# EAGLE design Sensor Board (EAGLE 6.4)
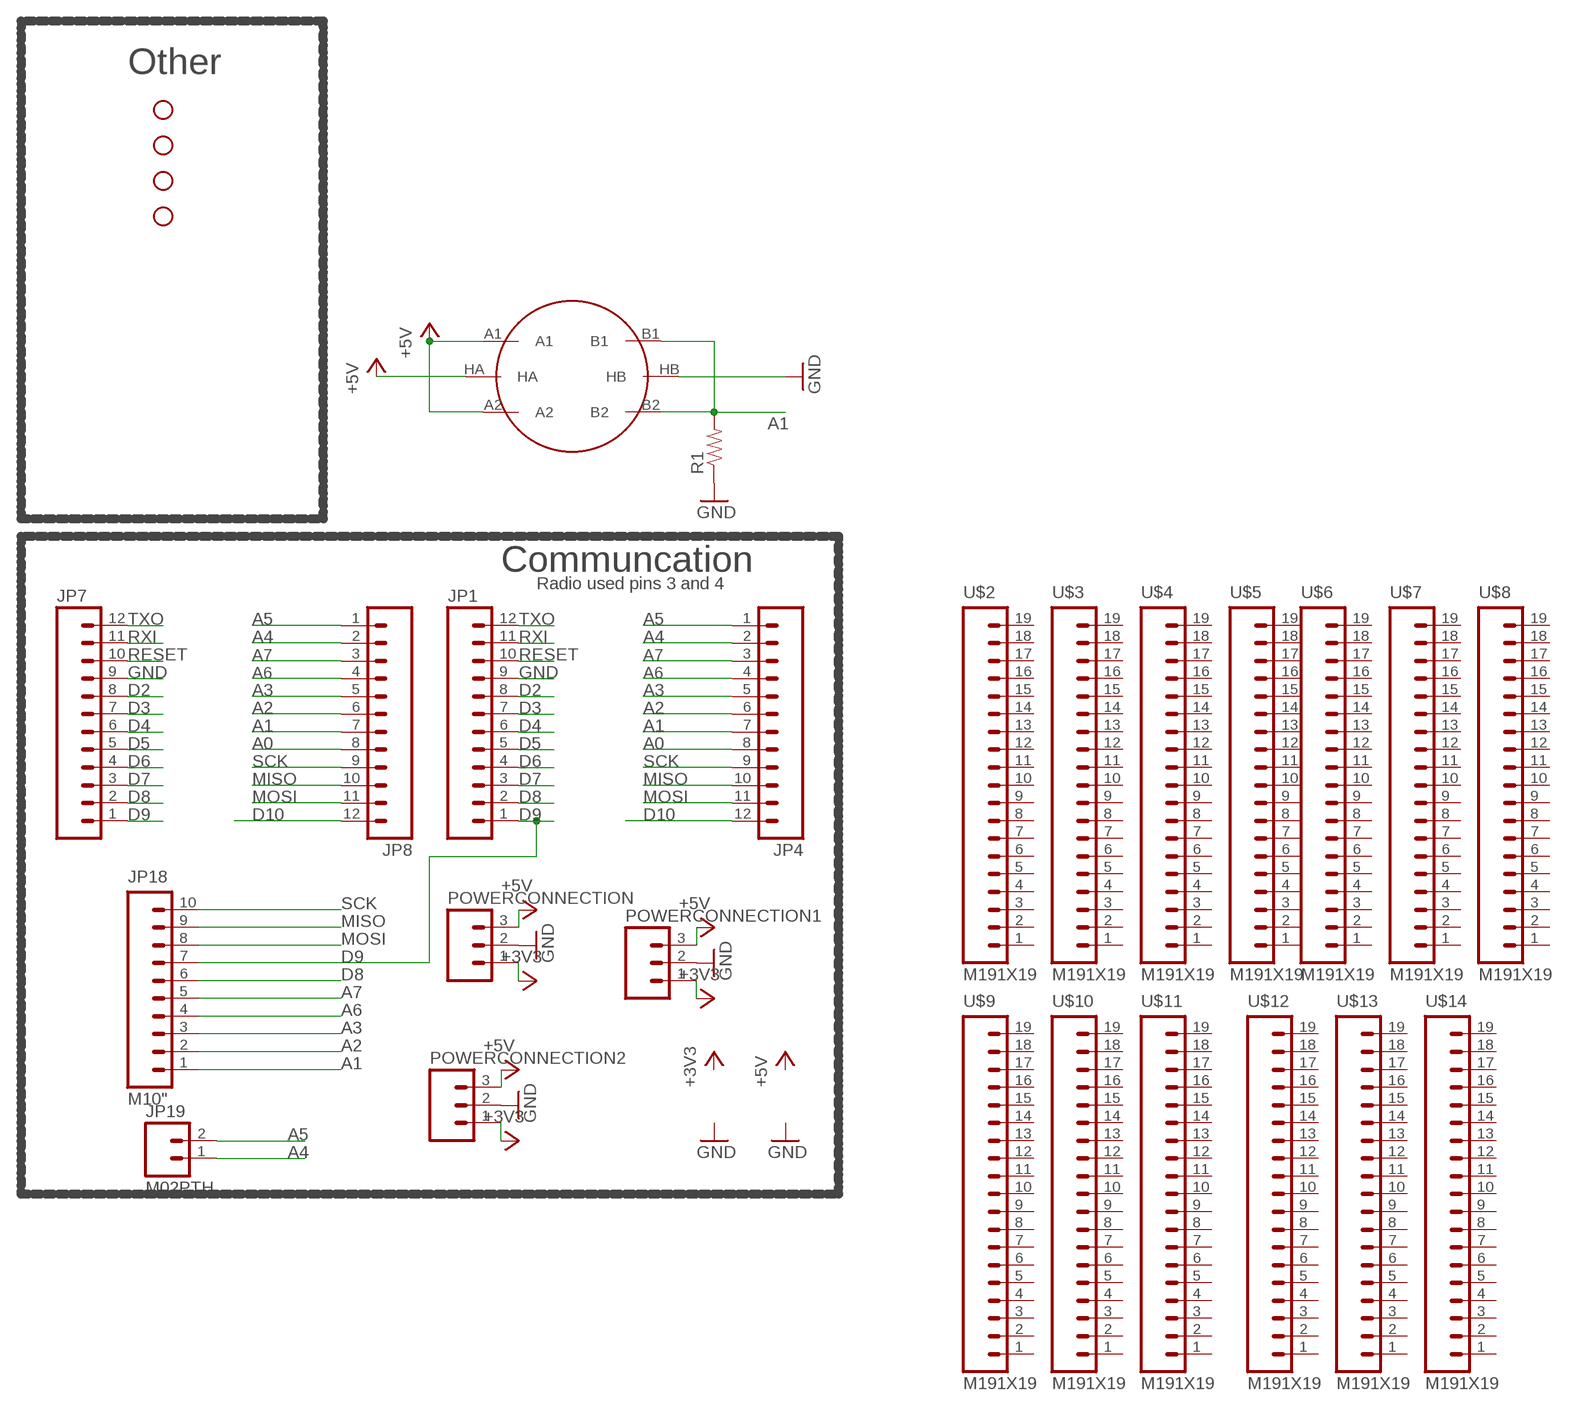
[diagram p0: schematic, sheet 1]

## Parts
JP1  M12PTH  [1X12]
JP4  M12PTH  [1X12]
JP7  M12PTH  [1X12]
JP8  M12PTH  [1X12]
JP18  M10"  [1X10]
JP19  M02PTH  [1X02]
POWERCONNECTION  M03PTH  [1X03]
POWERCONNECTION1  M03PTH  [1X03]
POWERCONNECTION2  M03PTH  [1X03]
R1  RESISTORPTH-1/4W  [AXIAL-0.4]
STANDOFF1  STAND-OFF  [STAND-OFF]
STANDOFF2  STAND-OFF  [STAND-OFF]
STANDOFF3  STAND-OFF  [STAND-OFF]
STANDOFF4  STAND-OFF  [STAND-OFF]
U$1  GAS_SOCKET  [MQ-3]
U$2  M191X19  [1X19]
U$3  M191X19  [1X19]
U$4  M191X19  [1X19]
U$5  M191X19  [1X19]
U$6  M191X19  [1X19]
U$7  M191X19  [1X19]
U$8  M191X19  [1X19]
U$9  M191X19  [1X19]
U$10  M191X19  [1X19]
U$11  M191X19  [1X19]
U$12  M191X19  [1X19]
U$13  M191X19  [1X19]
U$14  M191X19  [1X19]

## Nets
+3V3: POWERCONNECTION1.1 POWERCONNECTION2.1 POWERCONNECTION.1
+5V: POWERCONNECTION1.3 POWERCONNECTION2.3 POWERCONNECTION.3 U$1.A1 U$1.A2 U$1.HA
A0: JP4.8 JP8.8
A1: JP4.7 JP8.7 JP18.1 R1.P$2 U$1.B1 U$1.B2
A2: JP4.6 JP8.6 JP18.2
A3: JP4.5 JP8.5 JP18.3
A4: JP4.2 JP8.2 JP19.1
A5: JP4.1 JP8.1 JP19.2
A6: JP4.4 JP8.4 JP18.4
A7: JP4.3 JP8.3 JP18.5
D2: JP1.8 JP7.8
D3: JP1.7 JP7.7
D4: JP1.6 JP7.6
D5: JP1.5 JP7.5
D6: JP1.4 JP7.4
D7: JP1.3 JP7.3
D8: JP1.2 JP7.2 JP18.6
D9: JP1.1 JP7.1 JP18.7
D10: JP4.12 JP8.12
GND [vcc]: JP1.9 JP7.9 POWERCONNECTION1.2 POWERCONNECTION2.2 POWERCONNECTION.2 R1.P$1 U$1.HB
MISO: JP4.10 JP8.10 JP18.9
MOSI: JP4.11 JP8.11 JP18.8
RESET: JP1.10 JP7.10
RXI: JP1.11 JP7.11
SCK: JP4.9 JP8.9 JP18.10
TXO: JP1.12 JP7.12
Unconnected: U$2.1 U$2.2 U$2.3 U$2.4 U$2.5 U$2.6 U$2.7 U$2.8 U$2.9 U$2.10 U$2.11 U$2.12 U$2.13 U$2.14 U$2.15 U$2.16 U$2.17 U$2.18 U$2.19 U$3.1 U$3.2 U$3.3 U$3.4 U$3.5 U$3.6 U$3.7 U$3.8 U$3.9 U$3.10 U$3.11 U$3.12 U$3.13 U$3.14 U$3.15 U$3.16 U$3.17 U$3.18 U$3.19 U$4.1 U$4.2 U$4.3 U$4.4 U$4.5 U$4.6 U$4.7 U$4.8 U$4.9 U$4.10 U$4.11 U$4.12 U$4.13 U$4.14 U$4.15 U$4.16 U$4.17 U$4.18 U$4.19 U$5.1 U$5.2 U$5.3 U$5.4 U$5.5 U$5.6 U$5.7 U$5.8 U$5.9 U$5.10 U$5.11 U$5.12 U$5.13 U$5.14 U$5.15 U$5.16 U$5.17 U$5.18 U$5.19 U$6.1 U$6.2 U$6.3 U$6.4 U$6.5 U$6.6 U$6.7 U$6.8 U$6.9 U$6.10 U$6.11 U$6.12 U$6.13 U$6.14 U$6.15 U$6.16 U$6.17 U$6.18 U$6.19 U$7.1 U$7.2 U$7.3 U$7.4 U$7.5 U$7.6 U$7.7 U$7.8 U$7.9 U$7.10 U$7.11 U$7.12 U$7.13 U$7.14 U$7.15 U$7.16 U$7.17 U$7.18 U$7.19 U$8.1 U$8.2 U$8.3 U$8.4 U$8.5 U$8.6 U$8.7 U$8.8 U$8.9 U$8.10 U$8.11 U$8.12 U$8.13 U$8.14 U$8.15 U$8.16 U$8.17 U$8.18 U$8.19 U$9.1 U$9.2 U$9.3 U$9.4 U$9.5 U$9.6 U$9.7 U$9.8 U$9.9 U$9.10 U$9.11 U$9.12 U$9.13 U$9.14 U$9.15 U$9.16 U$9.17 U$9.18 U$9.19 U$10.1 U$10.2 U$10.3 U$10.4 U$10.5 U$10.6 U$10.7 U$10.8 U$10.9 U$10.10 U$10.11 U$10.12 U$10.13 U$10.14 U$10.15 U$10.16 U$10.17 U$10.18 U$10.19 U$11.1 U$11.2 U$11.3 U$11.4 U$11.5 U$11.6 U$11.7 U$11.8 U$11.9 U$11.10 U$11.11 U$11.12 U$11.13 U$11.14 U$11.15 U$11.16 U$11.17 U$11.18 U$11.19 U$12.1 U$12.2 U$12.3 U$12.4 U$12.5 U$12.6 U$12.7 U$12.8 U$12.9 U$12.10 U$12.11 U$12.12 U$12.13 U$12.14 U$12.15 U$12.16 U$12.17 U$12.18 U$12.19 U$13.1 U$13.2 U$13.3 U$13.4 U$13.5 U$13.6 U$13.7 U$13.8 U$13.9 U$13.10 U$13.11 U$13.12 U$13.13 U$13.14 U$13.15 U$13.16 U$13.17 U$13.18 U$13.19 U$14.1 U$14.2 U$14.3 U$14.4 U$14.5 U$14.6 U$14.7 U$14.8 U$14.9 U$14.10 U$14.11 U$14.12 U$14.13 U$14.14 U$14.15 U$14.16 U$14.17 U$14.18 U$14.19

## Notes on the sheet
- Other
- Communcation
- Radio used pins 3 and 4

## Library data of the parts
JP1 JP4 JP7 JP8 = SparkFun:M12: Header 12 Standard 12-pin 0.1" header. Use with straight break away headers (SKU : PRT-00116), right angle break away headers (PRT-00553), swiss pins (PRT-00743), machine pins (PRT-00117), and female headers (PRT-00115).
JP18 = SparkFun-Connectors:M10: Header 10 Standard 10-pin 0.1" header. Use with straight break away headers (SKU : PRT-00116), right angle break away headers (PRT-00553), swiss pins (PRT-00743), machine pins (PRT-00117), and female headers (PRT-00115).
JP19 = SparkFun-Connectors:M02: Standard 2-pin 0.1" header. Use with - straight break away headers ( PRT-00116) - right angle break away headers (PRT-00553) - swiss pins (PRT-00743) - machine pins (PRT-00117) - female headers (PRT-00115) Molex polarized connector foot print use with: PRT-08233 with associated crimp pins and housings. 2.54_SCREWTERM for use with PRT-10571. 3.5mm Screw Terminal footprints for PRT-08084 5mm Screw Terminal footprints for use with PRT-08433
POWERCONNECTION POWERCONNECTION1 POWERCONNECTION2 = SparkFun-Connectors:M03: Header 3 Standard 3-pin 0.1" header. Use with straight break away headers (SKU : PRT-00116), right angle break away headers (PRT-00553), swiss pins (PRT-00743), machine pins (PRT-00117), and female headers (PRT-00115). Molex polarized connector foot print use with SKU : PRT-08232 with associated crimp pins and housings.
R1 = SparkFun-Passives:RESISTOR: Resistor Basic schematic elements and footprints for 0603, 1206, and PTH resistors.
STANDOFF1-STANDOFF4 = SparkFun-Electromechanical:STAND-OFF: #4 Stand Off This is the mechanical footprint for a #4 phillips button head screw. Use the keepout ring to avoid running the screw head into surrounding components. SKU : PRT-00447
U$1 = SparkFun-Sensors:GAS_SOCKET
U$2-U$14 = SparkFun-Connectors:M19: 1x19 .1" header

## Net classes
1 vcc: width 0.254 mm
3 30: width 0.762 mm

## Board
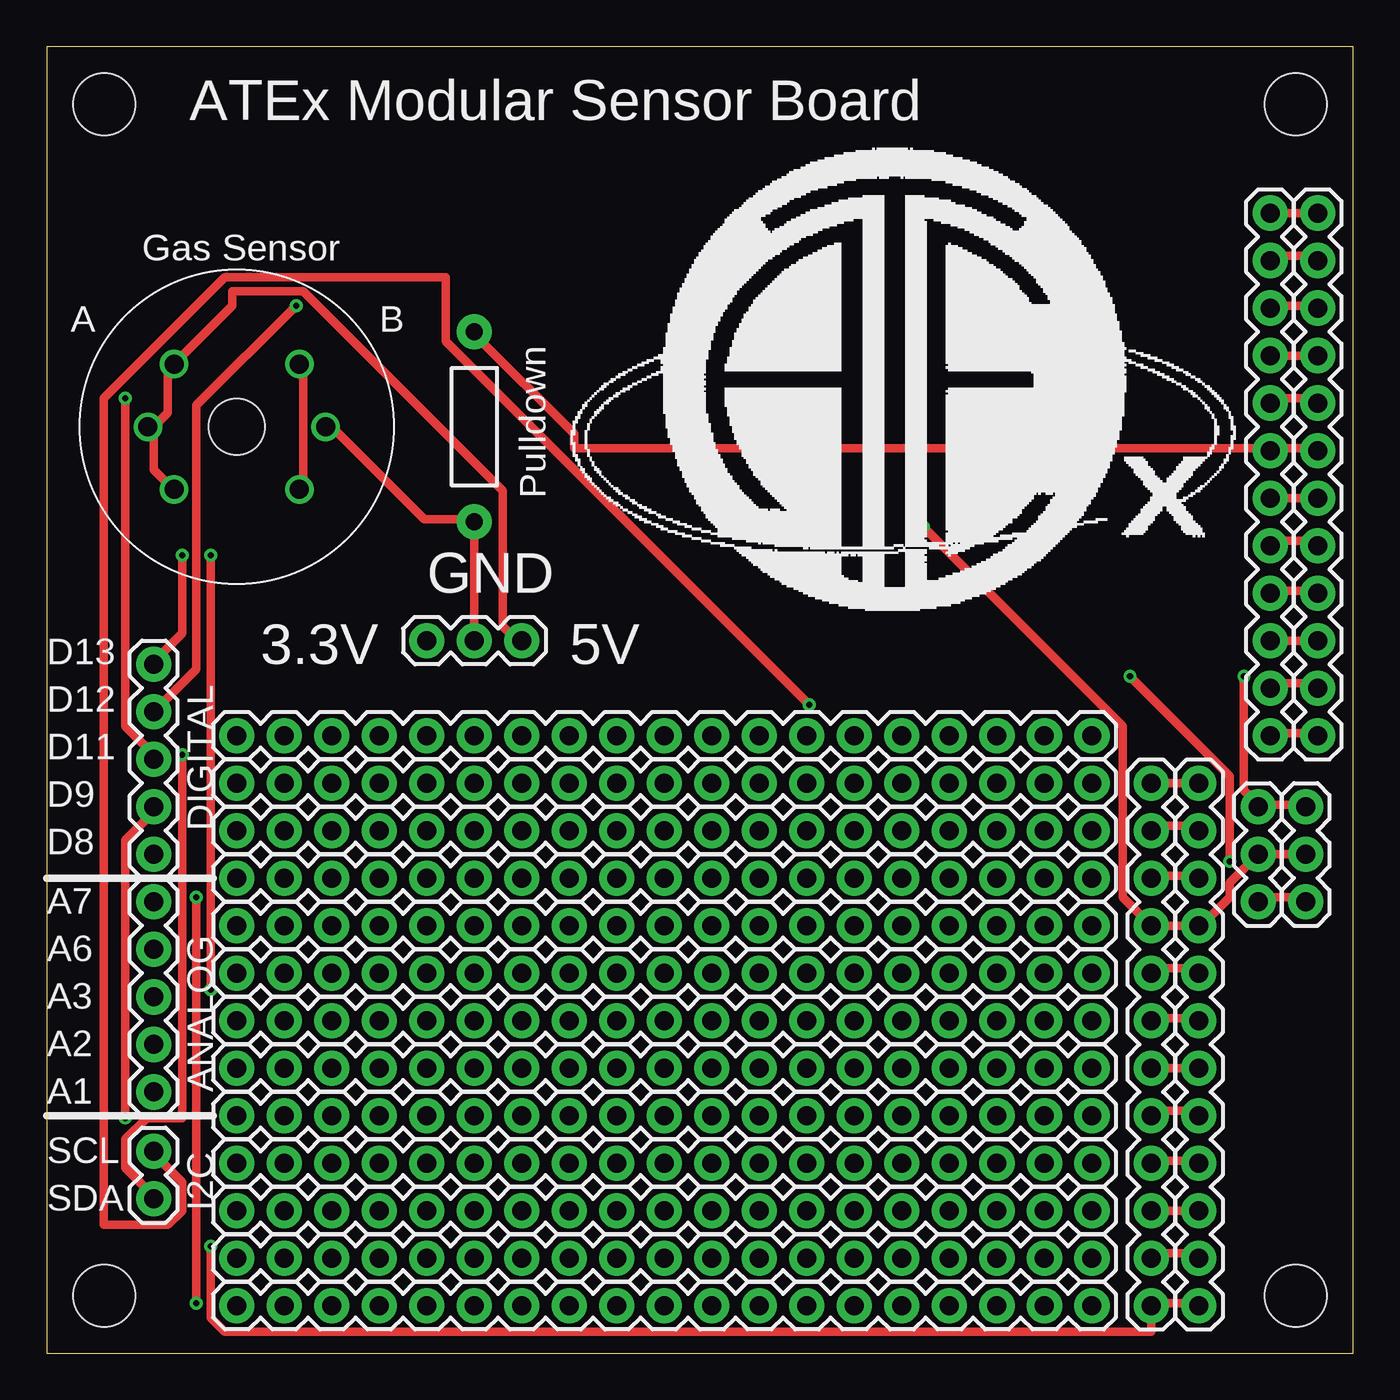
[diagram p1: board, top side]
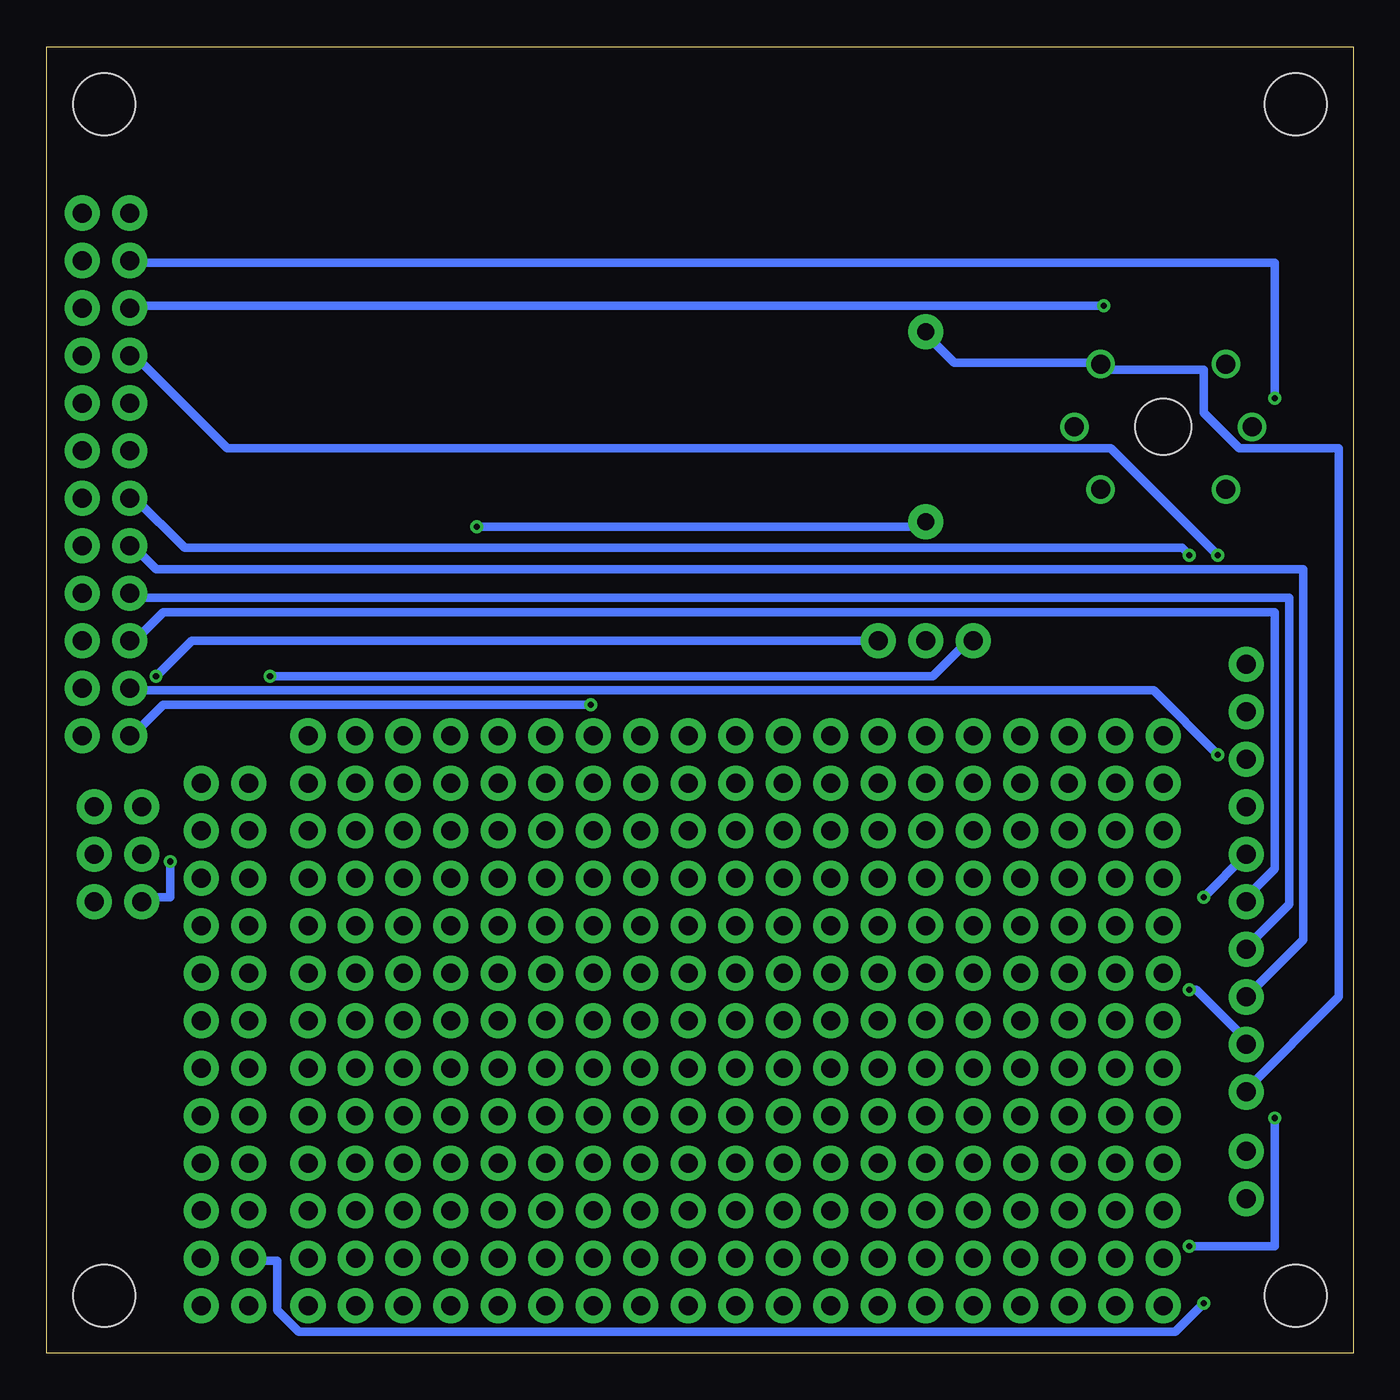
[diagram p2: board, bottom side, seen from below]

Size 69.85 x 69.85 mm. Coordinates in mm from the lower left corner, seen from the top.
Outline: 0,0 69.85,0 69.85,69.85 0,69.85 0,0
Copper layers (1*16): Top 0.0356mm / dielectric 1.5011mm / Bottom 0.0356mm
Design rules "OSHpark *": minimum track width 18mil, minimum drill 13mil, track to track 6mil, track to pad 6mil, pad to pad 6mil, via to via 6mil, smd to smd 6mil, copper to edge 15mil, drill to drill 6mil, minimum pad ring 7mil, minimum via ring 7mil, stop-mask expansion 4mil, vias tented up to drill 0mil, thermal gap 10mil

### Footprints (pad centres in the part's own frame; a part is rotated, then mirrored left to right if it is on the bottom)
1X12 = drill 1.016 pad 1.88: 1 0,0; 2 2.54,0; 3 5.08,0; 4 7.62,0; 5 10.16,0; 6 12.7,0; 7 15.24,0; 8 17.78,0; 9 20.32,0; 10 22.86,0; 11 25.4,0; 12 27.94,0
1X10 = drill 1.016 pad 1.88: 1 0,0; 2 2.54,0; 3 5.08,0; 4 7.62,0; 5 10.16,0; 6 12.7,0; 7 15.24,0; 8 17.78,0; 9 20.32,0; 10 22.86,0
1X02 = drill 1.016 pad 1.88: 1 0,0; 2 2.54,0
1X03 = drill 1.016 pad 1.88: 1 0,0; 2 2.54,0; 3 5.08,0
AXIAL-0.4 = drill 0.9 pad 1.88: P$1 -5.08,0; P$2 5.08,0
STAND-OFF = hole 3.302: 0,0
MQ-3 = drill 1.016: A1 -3.35,3.35; A2 -3.35,-3.35; B1 3.35,3.35; B2 3.35,-3.35; HA -4.75,0; HB 4.75,0 | hole 3: 0,0
1X19 = drill 1.016 pad 1.88: 1 0,0; 2 2.54,0; 3 5.08,0; 4 7.62,0; 5 10.16,0; 6 12.7,0; 7 15.24,0; 8 17.78,0; 9 20.32,0; 10 22.86,0; 11 25.4,0; 12 27.94,0; 13 30.48,0; 14 33.02,0; 15 35.56,0; 16 38.1,0; 17 40.64,0; 18 43.18,0; 19 45.72,0

### Placement (x,y rotation side)
JP1  59.05,2.54 90 top
JP4  67.94,33.02 90 top
JP7  61.59,2.54 90 top
JP8  65.41,33.02 90 top
JP18  5.71,13.97 90 top
JP19  5.71,8.26 90 top
POWERCONNECTION  64.77,24.13 90 top
POWERCONNECTION1  67.31,24.13 90 top
POWERCONNECTION2  20.32,38.1 0 top
R1  22.86,49.53 90 top
STANDOFF1  66.78,3.07 0 top
STANDOFF2  66.78,66.78 0 top
STANDOFF3  3.07,66.78 0 top
STANDOFF4  3.07,3.07 0 top
U$1  10.16,49.53 0 top
U$2  10.16,30.48 0 top
U$3  10.16,27.94 0 top
U$4  10.16,25.4 0 top
U$5  10.16,22.86 0 top
U$6  10.16,20.32 0 top
U$7  10.16,17.78 0 top
U$8  10.16,15.24 0 top
U$9  10.16,12.7 0 top
U$10  10.16,10.16 0 top
U$11  10.16,7.62 0 top
U$12  10.16,5.08 0 top
U$13  10.16,2.54 0 top
U$14  10.16,33.02 0 top

### Tracks (layer width: path | path; a pad name or v marks a point on that pad's centre or on a via)
+3V3  (via drill 0.33)
  Top 0.457: POWERCONNECTION.1 64.77,24.38 67.06,24.38 POWERCONNECTION1.1 | v57.91,36.2 63.25,30.86 v63.25,26.29
  Bottom 0.457: v57.91,36.2 22.48,36.2 20.57,38.1 POWERCONNECTION2.1 | v63.25,26.29 63.25,24.38 64.77,24.38 POWERCONNECTION.1
+5V  (via drill 0.33)
  Top 0.457: 64.77,29.34 67.06,29.34 POWERCONNECTION1.3 | 5.71,49.53 6.48,50.29 6.48,52.58 U$1.A1 6.86,52.96 9.91,56.01 9.91,56.77 13.72,56.77 24.38,46.1 24.38,38.86 25.15,38.1 POWERCONNECTION2.3 | 5.71,49.53 5.71,47.24 6.48,46.48 U$1.A2 | 5.71,49.53 U$1.HA | 64.77,29.34 64.01,30.1 v64.01,36.2 | 64.77,29.34 POWERCONNECTION.3
  Bottom 0.457: v64.01,36.2 62.1,38.1 POWERCONNECTION2.3
A0
  Top 0.457: JP8.8 65.53,51.05 67.82,51.05 JP4.8
A1
  Top 0.457: JP4.7 67.82,48.39 65.53,48.39 JP8.7 65.15,48.39 28.19,48.39 28.19,49.15 22.86,54.48 R1.P$2 | U$1.B2 13.72,46.48 13.72,52.58 U$1.B1
  Bottom 0.457: JP18.1 5.71,14.1 0.76,19.05 0.76,48.39 6.1,48.39 8,50.29 8,52.58 13.34,52.58 U$1.B1 13.72,52.96 21.34,52.96 22.86,54.48 R1.P$2
A2  (via drill 0.33)
  Top 0.457: v8.76,42.67 v8.76,19.43 | JP8.6 JP4.6
  Bottom 0.457: v8.76,19.43 8.38,19.43 5.71,16.76 JP18.2 | v8.76,42.67 9.14,43.05 62.48,43.05 65.15,45.72 JP8.6
A3
  Top 0.457: JP4.5 67.82,43.43 65.53,43.43 JP8.5
  Bottom 0.457: JP18.3 2.67,22.1 2.67,41.91 64.01,41.91 65.15,43.05 JP8.5
A4  (via drill 0.33)
  Top 0.457: v7.24,32 7.24,12.57 5.33,12.57 4.19,11.43 4.19,9.91 5.71,8.38 JP19.1 | JP4.2 67.82,35.81 65.53,35.81 JP8.2
  Bottom 0.457: v7.24,32 10.67,35.43 65.15,35.43 JP8.2
A5  (via drill 0.33)
  Top 0.457: v40.77,34.67 21.34,54.1 21.34,57.53 9.53,57.53 3.05,51.05 3.05,6.86 6.48,6.86 7.24,7.62 7.24,9.14 5.71,10.67 JP19.2 | JP4.1 67.82,33.15 65.53,33.15 JP8.1
  Bottom 0.457: v40.77,34.67 63.63,34.67 65.15,33.15 JP8.1
A6
  Top 0.457: JP4.4 67.82,40.77 65.53,40.77 JP8.4
  Bottom 0.457: JP18.4 5.71,21.72 3.43,24 3.43,40.39 65.15,40.39 JP8.4
A7
  Top 0.457: JP8.3 JP4.3
  Bottom 0.457: JP18.5 5.71,24.38 4.19,25.91 4.19,39.62 63.63,39.62 65.15,38.1 JP8.3
D2
  Top 0.457: JP1.8 59.05,20.57 61.34,20.57 JP7.8
D3
  Top 0.457: JP1.7 59.05,17.91 61.34,17.91 JP7.7
D4
  Top 0.457: JP7.6 JP1.6
D5
  Top 0.457: JP1.5 59.05,12.95 61.34,12.95 JP7.5
D6
  Top 0.457: JP1.4 59.05,10.29 61.34,10.29 JP7.4
D7
  Top 0.457: JP7.3 JP1.3
D8  (via drill 0.33)
  Top 0.457: JP1.2 59.05,5.33 61.34,5.33 JP7.2 | v8,2.67 v8,24.38
  Bottom 0.457: v8,24.38 JP18.6 | v8,2.67 9.53,1.14 56.39,1.14 57.53,2.29 57.53,4.95 59.05,4.95 JP1.2
D9  (via drill 0.33)
  Top 0.457: JP7.1 61.34,2.67 59.05,2.67 JP1.1 59.05,1.14 9.53,1.14 8.76,1.91 v8.76,5.71 | v4.19,12.57 4.19,27.43 5.71,28.96 JP18.7
  Bottom 0.457: v4.19,12.57 4.19,5.71 v8.76,5.71
D10
  Top 0.457: JP4.12 JP8.12
GND  (via drill 0.33)
  Top 0.457: POWERCONNECTION1.2 POWERCONNECTION.2 63.25,25.15 63.25,24.38 61.72,22.86 JP7.9 JP1.9 57.53,24.38 57.53,33.53 v46.86,44.2 | U$1.HB 15.24,49.53 20.19,44.58 22.86,44.58 R1.P$1 POWERCONNECTION2.2
  Bottom 0.457: v46.86,44.2 22.86,44.2 R1.P$1
MISO  (via drill 0.33)
  Top 0.457: JP18.9 8,36.58 8,50.67 v13.34,56.01 | JP4.10 67.82,56.01 65.53,56.01 JP8.10
  Bottom 0.457: v13.34,56.01 65.15,56.01 JP8.10
MOSI  (via drill 0.33)
  Top 0.457: v4.19,51.05 4.19,33.53 5.71,32 JP18.8 | JP4.11 67.82,58.67 65.53,58.67 JP8.11
  Bottom 0.457: v4.19,51.05 4.19,58.29 65.15,58.29 JP8.11
RESET
  Top 0.457: JP1.10 59.05,25.53 61.34,25.53 JP7.10
RXI
  Top 0.457: JP1.11 59.05,28.19 61.34,28.19 JP7.11
SCK  (via drill 0.33)
  Top 0.457: v7.24,42.67 7.24,38.48 5.71,36.96 JP18.10 | JP8.9 JP4.9
  Bottom 0.457: v7.24,42.67 12.95,48.39 60.2,48.39 65.15,53.34 JP8.9
TXO
  Top 0.457: JP7.12 JP1.12

### Text on the board
tNames: ATEx Modular Sensor Board | Gas Sensor | A | B | Pulldown | GND | D13 | 3.3V | 5V | D12 | D11 | D9 | DIGITAL | D8 | A7 | A6 | A3 | A2 | ANALOG | A1 | SCL | SDA | I2C